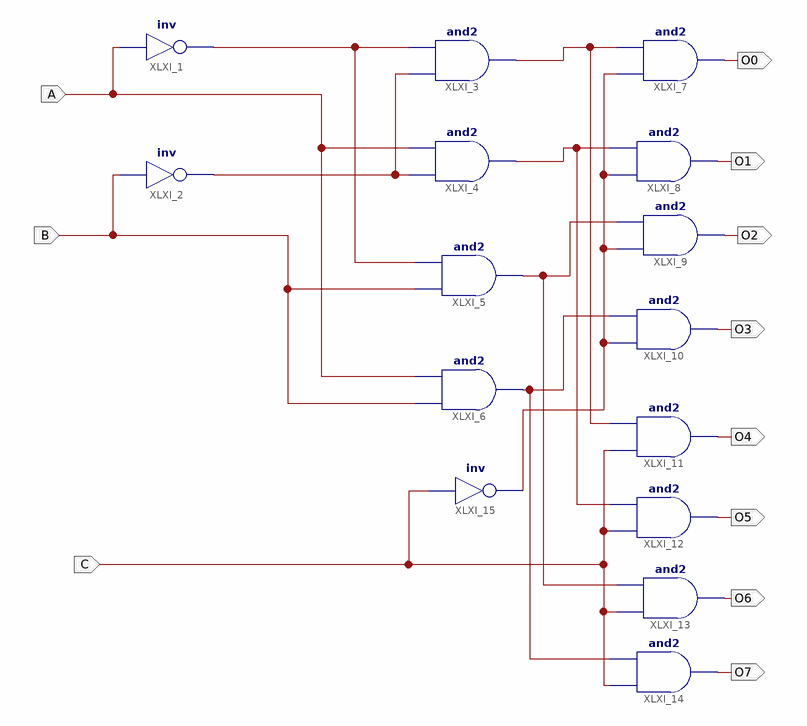
[diagram p0: schematic sheet 1]
// Xilinx ISE schematic Decoder_38_sch.sch (kintex7) as structural Verilog: 15 symbols, 11 ports
module Decoder_38_sch (
  input  A,
  input  B,
  input  C,
  output O0,
  output O1,
  output O2,
  output O3,
  output O4,
  output O5,
  output O6,
  output O7
);

  wire XLXN_11, XLXN_15, XLXN_18, XLXN_26, XLXN_27, XLXN_29, XLXN_31;

  not XLXI_1 (XLXN_15, A);
  not XLXI_2 (XLXN_11, B);
  and XLXI_3 (XLXN_26, XLXN_11, XLXN_15);
  and XLXI_4 (XLXN_27, XLXN_11, A);
  and XLXI_5 (XLXN_31, B, XLXN_15);
  and XLXI_6 (XLXN_29, B, A);
  and XLXI_7 (O0, XLXN_18, XLXN_26);
  and XLXI_8 (O1, XLXN_18, XLXN_27);
  and XLXI_9 (O2, XLXN_18, XLXN_31);
  and XLXI_10 (O3, XLXN_18, XLXN_29);
  and XLXI_11 (O4, C, XLXN_26);
  and XLXI_12 (O5, C, XLXN_27);
  and XLXI_13 (O6, C, XLXN_31);
  and XLXI_14 (O7, C, XLXN_29);
  not XLXI_15 (XLXN_18, C);
endmodule
